# Altium schematic sheet 04_BOOT.SchDoc
size A4
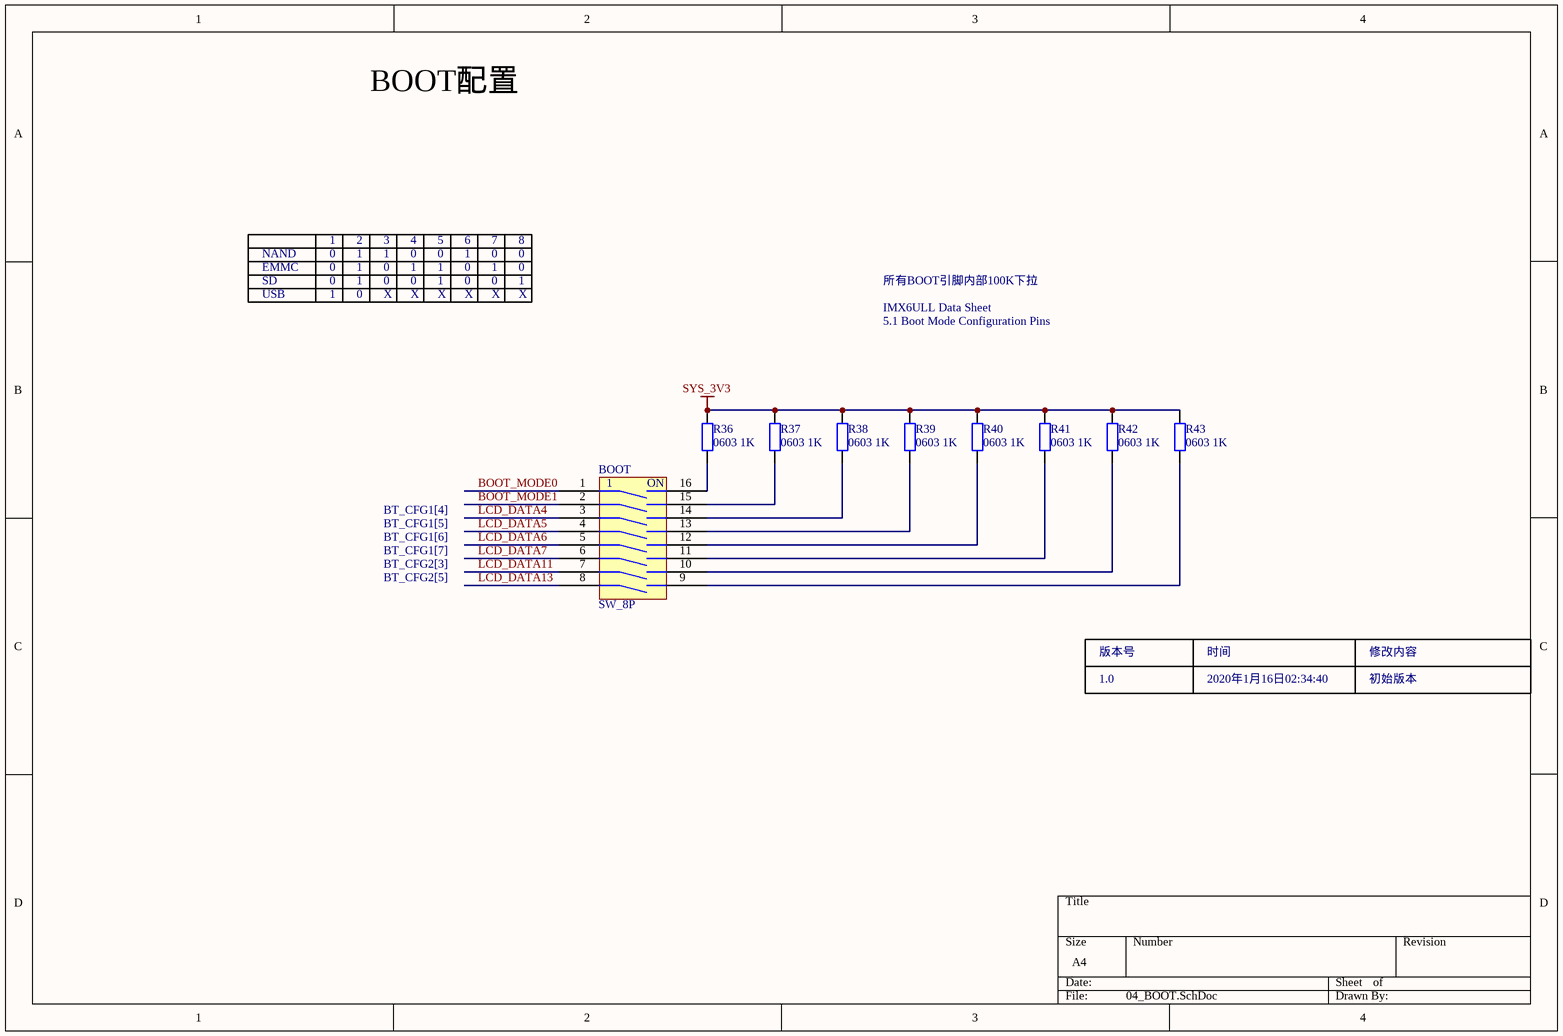
[diagram p0: 04_BOOT.SchDoc]

## Parts
BOOT  SW_8P  [SW_8P_2.54]
R36  0603 1K  [LC-0603_R]
R37  0603 1K  [LC-0603_R]
R38  0603 1K  [LC-0603_R]
R39  0603 1K  [LC-0603_R]
R40  0603 1K  [LC-0603_R]
R41  0603 1K  [LC-0603_R]
R42  0603 1K  [LC-0603_R]
R43  0603 1K  [LC-0603_R]

## Nets
SYS_3V3: R36.2 R37.2 R38.2 R39.2 R40.2 R41.2 R42.2 R43.2
BOOT_MODE0: BOOT.1
BOOT_MODE1: BOOT.2
LCD_DATA4: BOOT.3
LCD_DATA5: BOOT.4
LCD_DATA6: BOOT.5
LCD_DATA7: BOOT.6
LCD_DATA11: BOOT.7
LCD_DATA13: BOOT.8
NetBOOT_9: BOOT.9 R43.1
NetBOOT_10: BOOT.10 R42.1
NetBOOT_11: BOOT.11 R41.1
NetBOOT_12: BOOT.12 R40.1
NetBOOT_13: BOOT.13 R39.1
NetBOOT_14: BOOT.14 R38.1
NetBOOT_15: BOOT.15 R37.1
NetBOOT_16: BOOT.16 R36.1

## Notes on the sheet
- BOOT配置
- 1
- 2
- 3
- 4
- 5
- 6
- 7
- 8
- NAND
- EMMC
- SD
- USB
- 0
- X
- 所有BOOT引脚内部100K下拉
- IMX6ULL Data Sheet
- 5.1 Boot Mode Configuration Pins
- BT_CFG1[4]
- BT_CFG1[5]
- BT_CFG1[6]
- BT_CFG1[7]
- BT_CFG2[3]
- BT_CFG2[5]
- 版本号
- 时间
- 修改内容
- 1.0
- 2020年1月16日02:34:40
- 初始版本
- (in symbol SW_8P) ON

## Library data of the parts
R36-R43 = 0603 1.1KΩ (1101) 1%: 贴片电阻; ComponentLink1Description: 供应商链接; ComponentLink1URL: http://www.szlcsc.com/product/details_23491.html; Package: 0603; Supplier: LC; SuppliersPartNumber: C22764